# Altium project Maininboard.PrjPcb
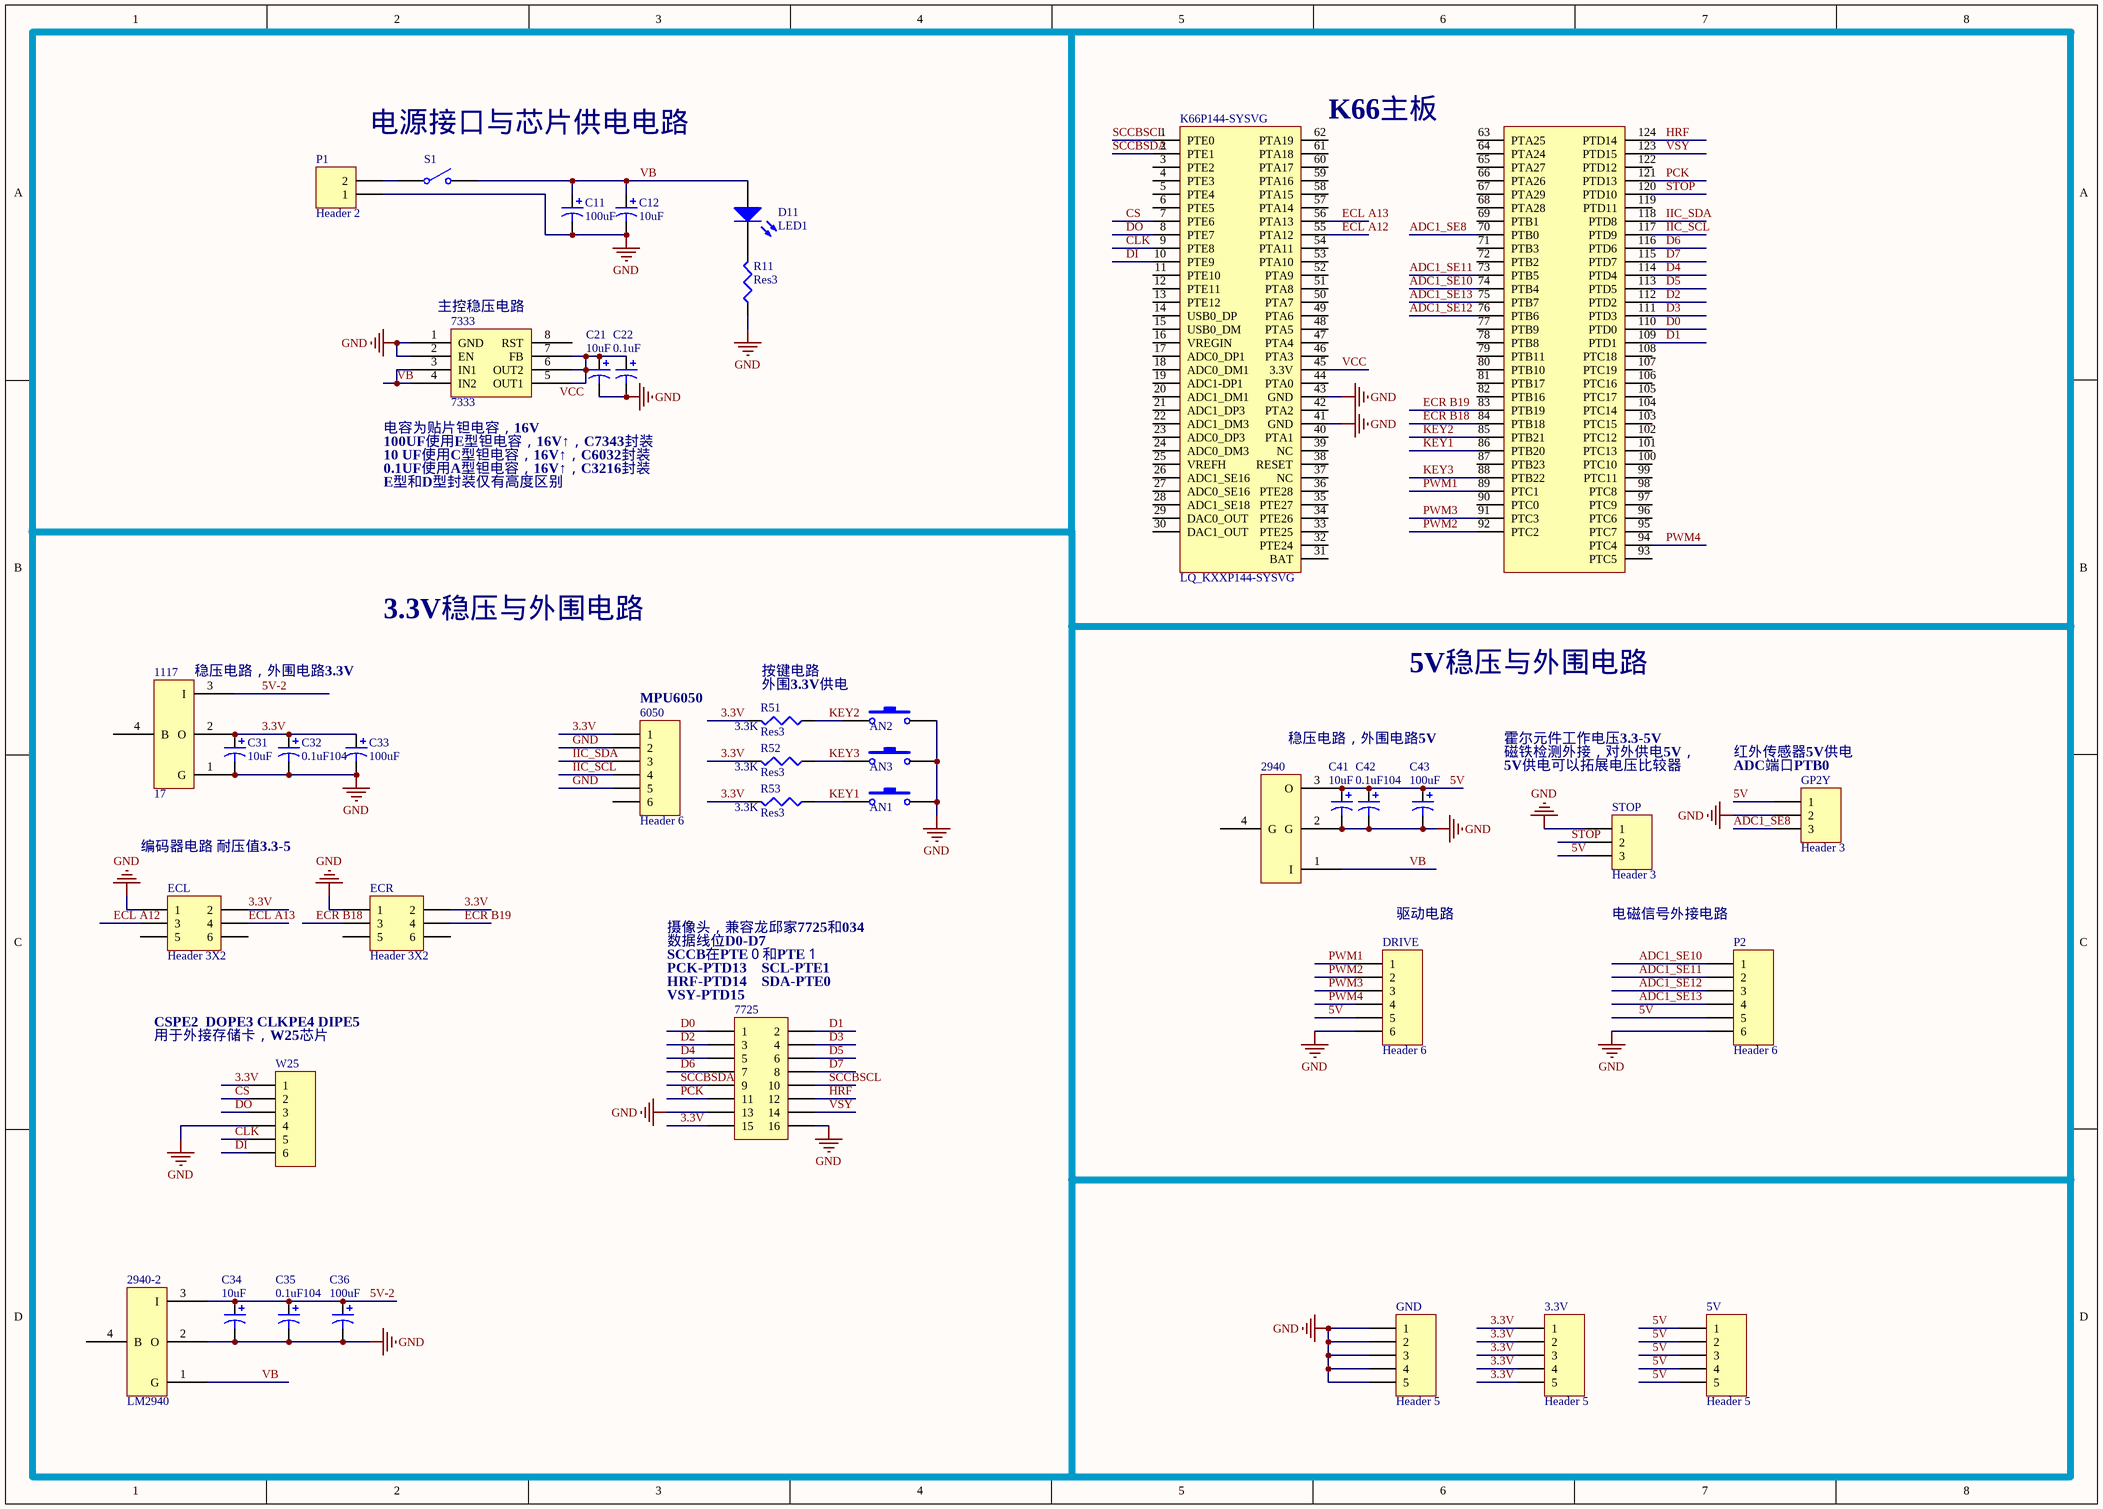
[diagram p0: Mainboard.SchDoc]
1 sheet, 40 parts. Net scope: global (net labels, ports and power ports of the same name join across sheets).
Board file: Mainboard.PcbDoc

## Sheet Mainboard.SchDoc
size A3

### Parts
3.3V  Header 5  [HDR1X5]
5V  Header 5  [HDR1X5]
1117  17  [SOT-223]
2940  40-1  [TO-220B]  (value not drawn)
2940-2  LM2940  [TO-220B]
6050  Header 6  [HX2.54-6]
7333  7333  [SO8_N]
7725  Header 8X2  [HDR2X8]  (value not drawn)
AN1  Button  [SMT4*6*2.5]  (value not drawn)
AN2  Button  [SMT4*6*2.5]  (value not drawn)
AN3  Button  [SMT4*6*2.5]  (value not drawn)
C11  value 100uF  [C7343]  (hidden comment: Cap Pol3)
C12  value 10uF  [C6032]  (hidden comment: Cap Pol3)
C21  value 10uF  [C6032]  (hidden comment: Cap Pol3)
C22  value 0.1uF  [C3216]  (hidden comment: Cap Pol3)
C31  value 10uF  [C6032]  (hidden comment: Cap Pol3)
C32  value 0.1uF104  [C3216]  (hidden comment: Cap Pol3)
C33  value 100uF  [C7343]  (hidden comment: Cap Pol3)
C34  value 10uF  [C6032]  (hidden comment: Cap Pol3)
C35  value 0.1uF104  [C3216]  (hidden comment: Cap Pol3)
C36  value 100uF  [C7343]  (hidden comment: Cap Pol3)
C41  value 10uF  [C6032]  (hidden comment: Cap Pol3)
C42  value 0.1uF104  [C3216]  (hidden comment: Cap Pol3)
C43  value 100uF  [C7343]  (hidden comment: Cap Pol3)
D11  LED1  [C1206]
DRIVE  Header 6  [HX2.54-6]
ECL  Header 3X2  [HDR2X3]
ECR  Header 3X2  [HDR2X3]
GND  Header 5  [HDR1X5]
GP2Y  Header 3  [HX2.54-3]
K66P144-SYSVG  LQ_KXXP144-SYSVG  [LQ_KXXP144-SYSVG]
P1  Header 2  [2PIN-5.08A]
P2  Header 6  [HDR1X6]
R11  Res3  [R0805]
R51  Res3  value 3.3K  [R0805]
R52  Res3  value 3.3K  [R0805]
R53  Res3  value 3.3K  [R0805]
S1  S2W  [SW-TO3]  (value not drawn)
STOP  Header 3  [HX2.54-3]
W25  MHDR1X6  [HDR1X6]  (value not drawn)

### Nets
GND: 1117.1(G) 2940.2(G) 2940-2.2(O) 6050.2 6050.5 7333.1(GND) 7333.2(EN) 7725.13 7725.16 AN1.1 AN2.1 AN3.1 C11.2 C12.2 C21.2 C22.2 C31.2 C32.2 C33.2 C34.2 C35.2 C36.2 C41.2 C42.2 C43.2 DRIVE.6 ECL.1 ECR.1 GND.1 GND.2 GND.3 GND.4 GND.5 GP2Y.2 K66P144-SYSVG.41(GND) K66P144-SYSVG.43(GND) P1.1 P2.6 R11.1 STOP.1 W25.4
3.3V: 3.3V.1 3.3V.2 3.3V.3 3.3V.4 3.3V.5 1117.2(O) 6050.1 7725.15 C31.1 C32.1 C33.1 ECL.2 ECR.2 R51.2 R52.2 R53.2 W25.1
5V: 5V.1 5V.2 5V.3 5V.4 5V.5 2940.3(O) C41.1 C42.1 C43.1 DRIVE.5 GP2Y.1 P2.5 STOP.3
5V-2: 1117.3(I) 2940-2.3(I) C34.1 C35.1 C36.1
ADC1_SE8: GP2Y.3 K66P144-SYSVG.70(PTB0)
ADC1_SE10: K66P144-SYSVG.74(PTB4) P2.1
ADC1_SE11: K66P144-SYSVG.73(PTB5) P2.2
ADC1_SE12: K66P144-SYSVG.76(PTB6) P2.3
ADC1_SE13: K66P144-SYSVG.75(PTB7) P2.4
CLK: K66P144-SYSVG.9(PTE8) W25.5
CS: K66P144-SYSVG.7(PTE6) W25.2
D0: 7725.1 K66P144-SYSVG.110(PTD0)
D1: 7725.2 K66P144-SYSVG.109(PTD1)
D2: 7725.3 K66P144-SYSVG.112(PTD2)
D3: 7725.4 K66P144-SYSVG.111(PTD3)
D4: 7725.5 K66P144-SYSVG.114(PTD4)
D5: 7725.6 K66P144-SYSVG.113(PTD5)
D6: 7725.7 K66P144-SYSVG.116(PTD6)
D7: 7725.8 K66P144-SYSVG.115(PTD7)
DI: K66P144-SYSVG.10(PTE9) W25.6
DO: K66P144-SYSVG.8(PTE7) W25.3
ECL A12: ECL.3 K66P144-SYSVG.55(PTA12)
ECL A13: ECL.4 K66P144-SYSVG.56(PTA13)
ECR B18: ECR.3 K66P144-SYSVG.84(PTB18)
ECR B19: ECR.4 K66P144-SYSVG.83(PTB19)
HRF: 7725.12 K66P144-SYSVG.124(PTD14)
IIC_SCL: 6050.4 K66P144-SYSVG.117(PTD9)
IIC_SDA: 6050.3 K66P144-SYSVG.118(PTD8)
KEY1: AN1.2 K66P144-SYSVG.86(PTB20) R53.1
KEY2: AN2.2 K66P144-SYSVG.85(PTB21) R51.1
KEY3: AN3.2 K66P144-SYSVG.88(PTB22) R52.1
PCK: 7725.11 K66P144-SYSVG.121(PTD13)
PWM1: DRIVE.1 K66P144-SYSVG.89(PTC1)
PWM2: DRIVE.2 K66P144-SYSVG.92(PTC2)
PWM3: DRIVE.3 K66P144-SYSVG.91(PTC3)
PWM4: DRIVE.4 K66P144-SYSVG.94(PTC4)
SCCBSCL: 7725.10 K66P144-SYSVG.1(PTE0)
SCCBSDA: 7725.9 K66P144-SYSVG.2(PTE1)
STOP: K66P144-SYSVG.120(PTD10) STOP.2
VB: 2940.1(I) 2940-2.1(G) 7333.3(IN1) 7333.4(IN2) C11.1 C12.1 D11.1(A) S1.2(NO)
VCC: 7333.5(OUT1) 7333.6(OUT2) 7333.7(FB) C21.1 C22.1 K66P144-SYSVG.45(3.3V)
VSY: 7725.14 K66P144-SYSVG.123(PTD15)
NetD11_2: D11.2(K) R11.2
NetP1_2: P1.2 S1.1(COMMON)

Not connected (* = marked no-connect by the designer): 1117 4(B); 2940 4(G); 2940-2 4(B); 6050 6; 7333 8(RST); ECL 5 6; ECR 5 6; K66P144-SYSVG 3(PTE2) 4(PTE3) 5(PTE4) 6(PTE5) 11(PTE10) 12(PTE11) 13(PTE12) 14(USB0_DP) 15(USB0_DM) 16(VREGIN) 17(ADC0_DP1) 18(ADC0_DM1) 19(ADC1-DP1) 20(ADC1_DM1) 21(ADC1_DP3) 22(ADC1_DM3) 23(ADC0_DP3) 24(ADC0_DM3) 25(VREFH) 26(ADC1_SE16) 27(ADC0_SE16) 28(ADC1_SE18) 29(DAC0_OUT) 30(DAC1_OUT) 31(BAT) 32(PTE24) 33(PTE25) 34(PTE26) 35(PTE27) 36(PTE28) 37(NC) 38(RESET) 39(NC) 40(PTA1) 42(PTA2) 44(PTA0) 46(PTA3) 47(PTA4) 48(PTA5) 49(PTA6) 50(PTA7) 51(PTA8) 52(PTA9) 53(PTA10) 54(PTA11) 57(PTA14) 58(PTA15) 59(PTA16) 60(PTA17) 61(PTA18) 62(PTA19) 63(PTA25) 64(PTA24) 65(PTA27) 66(PTA26) 67(PTA29) 68(PTA28) 69(PTB1) 71(PTB3) 72(PTB2) 77(PTB9) 78(PTB8) 79(PTB11) 80(PTB10) 81(PTB17) 82(PTB16) 87(PTB23) 90(PTC0) 93(PTC5) 95(PTC7) 96(PTC6) 97(PTC9) 98(PTC8) 99(PTC11) 100(PTC10) 101(PTC13) 102(PTC12) 103(PTC15) 104(PTC14) 105(PTC17) 106(PTC16) 107(PTC19) 108(PTC18) 119(PTD11) 122(PTD12)

### Notes on the sheet
- 电源接口与芯片供电电路
- (near K66P144-SYSVG) K66主板
- (near 7333) 主控稳压电路
- (near 7333) 电容为贴片钽电容，16V
- 100UF使用E型钽电容，16V↑，C7343封装
- 10 UF使用C型钽电容，16V↑，C6032封装
- 0.1UF使用A型钽电容，16V↑，C3216封装
- E型和D型封装仅有高度区别
- 3.3V稳压与外围电路
- (near 1117) 稳压电路，外围电路3.3V
- (near 6050) MPU6050
- (near R51) 按键电路
- (near R51) 外围3.3V供电
- 5V稳压与外围电路
- 稳压电路，外围电路5V
- 霍尔元件工作电压3.3-5V
- 磁铁检测外接，对外供电5V，
- 5V供电可以拓展电压比较器
- (near GP2Y) 红外传感器5V供电
- (near GP2Y) ADC端口PTB0
- 编码器电路 耐压值3.3-5
- (near DRIVE) 驱动电路
- 电磁信号外接电路
- 摄像头，兼容龙邱家7725和034
- 数据线位D0-D7
- SCCB在PTE０和PTE１
- (near 7725) HRF-PTD14
- PCK-PTD13
- SCL-PTE1
- (near 7725) SDA-PTE0
- (near W25) 用于外接存储卡，W25芯片
- CSPE2  DOPE3 CLKPE4 DIPE5
- (near 7725) VSY-PTD15

### Library data of the parts
3.3V 5V GND = Header 5: Header, 5-Pin; LatestRevisionDate: 17-Jul-2002; LatestRevisionNote: Re-released for DXP Platform.; Publisher: Altium Limited
1117 = AMS1117: SOT-223
2940 2940-2 = LM2940: SOT-223
6050 DRIVE P2 = Header 6: Header, 6-Pin; LatestRevisionDate: 17-Jul-2002; LatestRevisionNote: Re-released for DXP Platform.; Publisher: Altium Limited
7725 = Header 8X2: Header, 8-Pin, Dual row; LatestRevisionDate: 17-Jul-2002; LatestRevisionNote: Re-released for DXP Platform.; Publisher: Altium Limited
C11 C12 C21 C22 C31-C36 C41-C43 = Cap Pol3: Polarized Capacitor (Surface Mount); Published: 8-Jun-2000; LatestRevisionDate: 29-May-2009; LatestRevisionNote: IPC-7351 Footprint Added.; PackageReference: C0805; Publisher: Altium Limited; PackageDescription: Chip Capacitor
D11 = LED3: Typical BLUE SiC LED; Published: 8-Jun-2000; LatestRevisionDate: 17-Dec-2003; LatestRevisionNote: PCB Footprint replaced.; DatasheetVersion: 16-Apr-2002; PackageVersion: 16-Apr-2002; PackageReference: 3.5X2.8X1.9; Publisher: Altium Limited; PackageDescription: SM LED; 2 C-Bend Leads; Body 3.5 x 2.8 x 1.9 mm, inc leads (LxWxH typ)
ECL ECR = Header 3X2: Header, 3-Pin, Dual row; LatestRevisionDate: 17-Jul-2002; LatestRevisionNote: Re-released for DXP Platform.; Publisher: Altium Limited
GP2Y STOP = Header 3: Header, 3-Pin; LatestRevisionDate: 17-Jul-2002; LatestRevisionNote: Re-released for DXP Platform.; Publisher: Altium Limited
P1 = Header 2: Header, 2-Pin; LatestRevisionDate: 17-Jul-2002; LatestRevisionNote: Re-released for DXP Platform.; Publisher: Altium Limited
R11 R51-R53 = Res3: Resistor; Published: 8-Jun-2000; LatestRevisionDate: 29-May-2009; LatestRevisionNote: IPC-7351 Footprint Added.; PackageReference: J1-0603; Publisher: Altium Limited; PackageDescription: Chip Resistor
S1 = SW-SPST: Single-Pole, Single-Throw Switch; Published: 24-Mar-1999; LatestRevisionDate: 17-Jul-2002; LatestRevisionNote: Re-released for DXP Platform.; PackageReference: SPST-2; Publisher: Altium Limited; PackageDescription: Switch; 2 Leads
W25 = MHDR1X6: Header, 6-Pin; Revision: 17-Jul-2002: Re-released for DXP Platform.; Publisher: Altium Limited
AN1-AN3 = Button: Published: 24-Mar-1999; LatestRevisionDate: 17-Jul-2002; LatestRevisionNote: Re-released for DXP Platform.; PackageReference: SPST-2; Publisher: Altium Limited